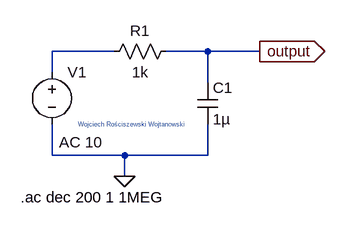
[diagram p0: schematic Frequency analysis of the RC circuit.asc]
Frequency analysis of the RC circuit.asc, the LTspice schematic file:
Version 4
SHEET 1 880 680
WIRE 160 96 64 96
WIRE 304 96 240 96
WIRE 384 96 304 96
WIRE 64 128 64 96
WIRE 304 144 304 96
WIRE 64 256 64 208
WIRE 176 256 64 256
WIRE 304 256 304 208
WIRE 304 256 176 256
WIRE 176 288 176 256
FLAG 176 288 0
FLAG 384 96 output
IOPIN 384 96 Out
SYMBOL res 256 80 R90
WINDOW 0 0 56 VBottom 2
WINDOW 3 32 56 VTop 2
SYMATTR InstName R1
SYMATTR Value 1k
SYMBOL voltage 64 112 R0
WINDOW 123 11 124 Left 2
WINDOW 39 0 0 Left 0
SYMATTR Value2 AC 10
SYMATTR InstName V1
SYMATTR Value ""
SYMBOL cap 288 144 R0
SYMATTR InstName C1
SYMATTR Value 1µ
TEXT 16 320 Left 2 !.ac dec 200 1 1MEG
TEXT 104 208 Left 0 ;Wojciech Rościszewski Wojtanowski

The netlist it stands for:
* Frequency analysis of the RC circuit.asc
R1 output N001 1k
V1 N001 0 AC 10
C1 output 0 1µ
.ac dec 200 1 1MEG
* Wojciech Rościszewski Wojtanowski
.backanno
.end